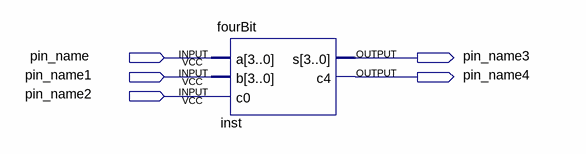
[diagram p0: schematic sheet]
// Quartus schematic fourBit_adder.bdf as structural Verilog: 1 symbols, 5 pins
module fourBit_adder (
  input  pin_name,
  input  pin_name1,
  input  pin_name2,
  output pin_name3,
  output pin_name4
);

  fourBit inst (.s(pin_name3), .c4(pin_name4));  // open: a, b, c0
endmodule
